# Altium project Test_PCB_Project1.PrjPcb
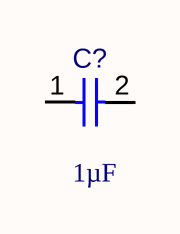
[diagram p0: Sheet1.SchDoc]
ABCD: XYZ; Altium: Sogol; Name: Ahsen; Second_Name: Miskeen
1 sheet, 1 parts. Net scope: global (net labels, ports and power ports of the same name join across sheets).
Board file: PCB1.PcbDoc

## Sheet Sheet1.SchDoc
size A; SheetNumber: 1; SheetTotal: 1

### Parts
C?  value 1µF  [CAPC2013X145X50ML20T25]  (hidden comment: Capacitor 1 uF +/- 10% 25 V 0805)

### Nets

Not connected (* = marked no-connect by the designer): C? 1 2

### Library data of the parts
C? = CMP-001-00010-6: Chip Capacitor, 1 uF, +/-10%, 25 V, 0805 (2012 Metric); Capacitor Type: Ceramic; Voltage Rating: 25V; RoHS Compliant: True; Pins: 2; Mounting Technology: SM; Max Operating Temperature: 125°C; Min Operating Temperature: -55°C; Tolerance: 10%; Case/Package: 0805